# EAGLE design audio_amplifier (EAGLE 6.2)
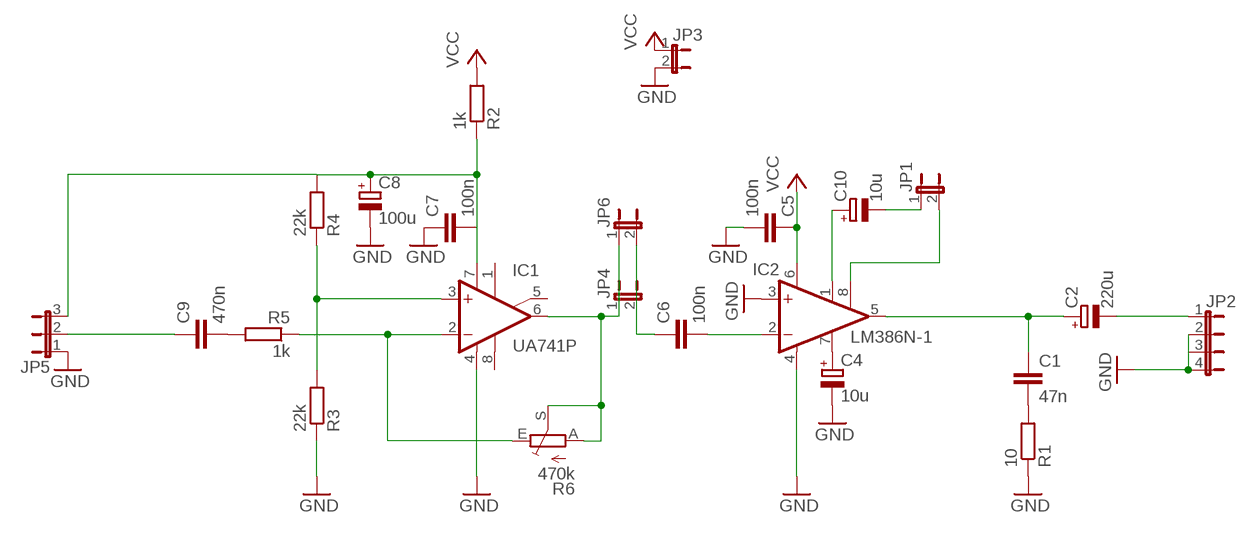
[diagram p0: schematic, sheet 1]

## Parts
C1  47n  C-EU025-024X044  [C025-024X044]
C2  220u  CPOL-EUE2.5-6  [E2,5-6]
C4  10u  CPOL-EUB/3528-21R  [B/3528-21R]
C5  100n  C-EU050-025X075  [C050-025X075]
C6  100n  C-EU050-025X075  [C050-025X075]
C7  100n  C-EU025-024X044  [C025-024X044]
C8  100u  CPOL-EUE2.5-5  [E2,5-5]
C9  470n  C-EU050-025X075  [C050-025X075]
C10  10u  CPOL-EUE2.5-5  [E2,5-5]
IC1  UA741P  [DIL08]
IC2  LM386N-1  [DIL08]
JP1  JP1E  [JP1]
JP2  JP4E  [JP4]
JP3  JP1E  [JP1]
JP4  JP1E  [JP1]
JP5  JP2E  [JP2]
JP6  JP1E  [JP1]
R1  10  R-EU_0204/5  [0204/5]
R2  1k  R-EU_0204/5  [0204/5]
R3  22k  R-EU_0204/7  [0204/7]
R4  22k  R-EU_0204/5  [0204/5]
R5  1k  R-EU_0204/2V  [0204V]
R6  470k  TRIM_EU-B64Y  [B64Y]

## Nets
GND: C4.- C5.2 C7.1 C8.- IC1.4(V-) IC2.3(+IN) IC2.4(GND) JP2.2 JP2.3 JP2.4 JP3.2 JP5.1 R1.1 R3.1
N$1: C10.+ IC2.1(GAIN)
N$2: C1.2 R1.2
N$4: C4.+ IC2.7(BYPASS)
N$6: C6.2 IC2.2(-IN)
N$7: C7.2 C8.+ IC1.7(V+) JP5.3 R2.1 R4.2
N$8: IC1.3(+IN) R3.2 R4.1
N$9: C9.2 R5.2
N$10: IC1.2(-IN) R5.1 R6.E
N$11: C2.- JP2.1
N$12: C10.- JP1.1
N$13: IC2.8(GAIN) JP1.2
N$14: C6.1 JP4.2 JP6.2
N$15: IC1.6(OUT) JP4.1 JP6.1 R6.A R6.S
N$17: C1.1 C2.+ IC2.5(OUT)
N$19: C9.1 JP5.2
VCC: C5.1 IC2.6(VS) JP3.1 R2.2
Unconnected: IC1.1(ON1) IC1.5(ON2) IC1.8(OPT)

## Library data of the parts
C1 C5-C7 C9 = rcl:C-EU: CAPACITOR, European symbol
C2 C4 C8 C10 = rcl:CPOL-EU: POLARIZED CAPACITOR, European symbol
IC1 = linear:*741: OP AMP
IC2 = linear:LM386?-*: Low Voltage Audio Power Amplifier Source: http://cache.national.com/ds/LM/LM386.pdf
JP1 JP3 JP4 JP6 = jumper:JP1E: JUMPER
JP2 = jumper:JP4E: JUMPER
JP5 = jumper:JP2E: JUMPER
R1-R5 = rcl:R-EU_: RESISTOR, European symbol
R6 = pot:TRIM_EU-: POTENTIOMETER

## Board
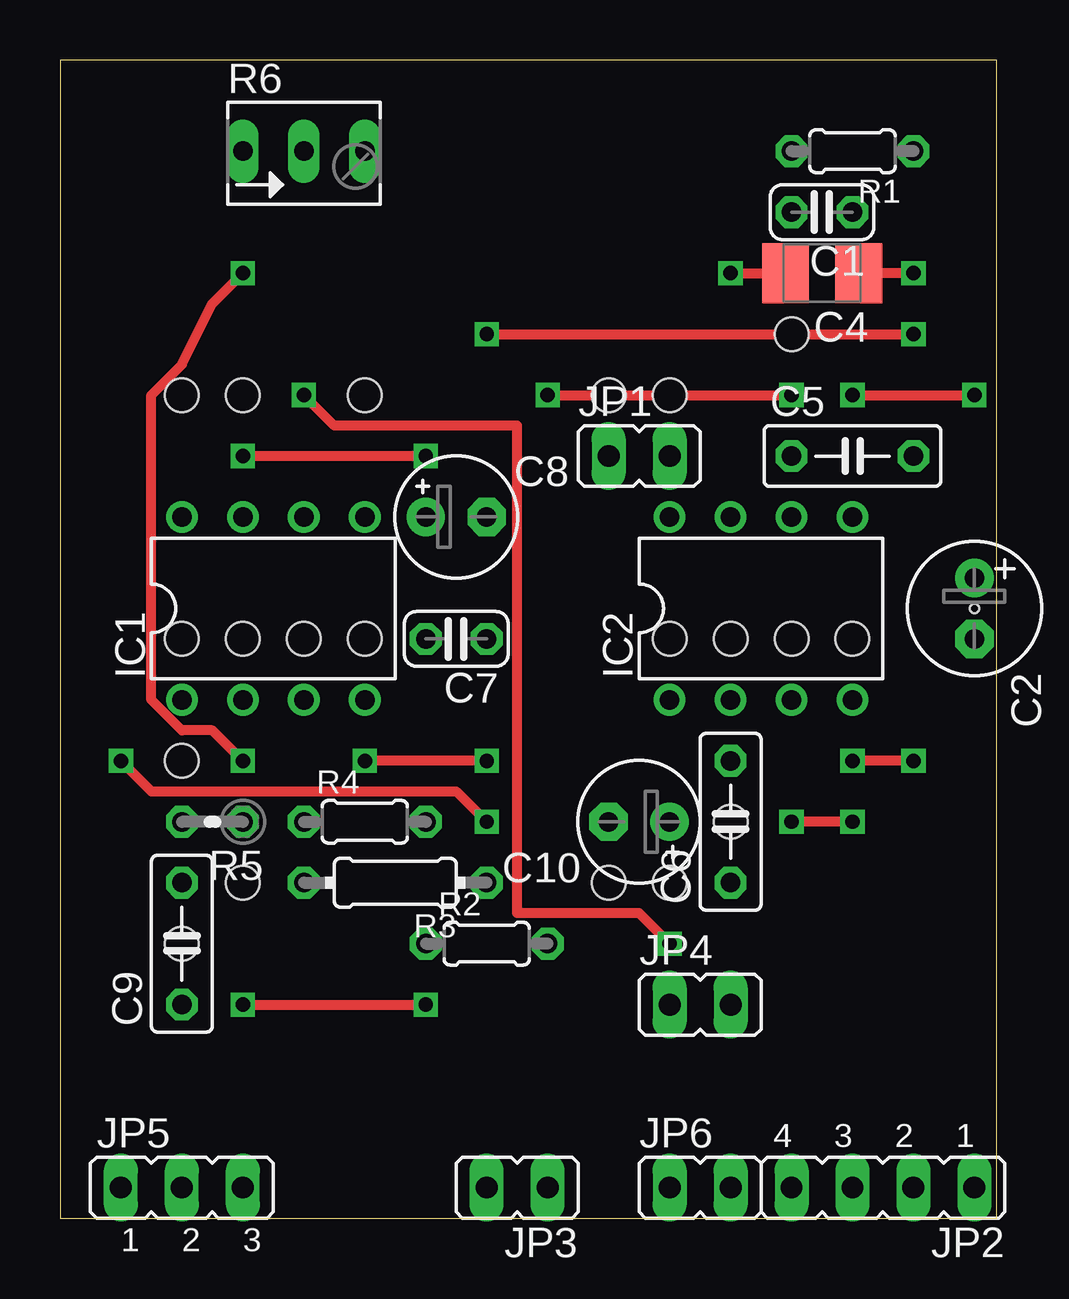
[diagram p1: board, top side]
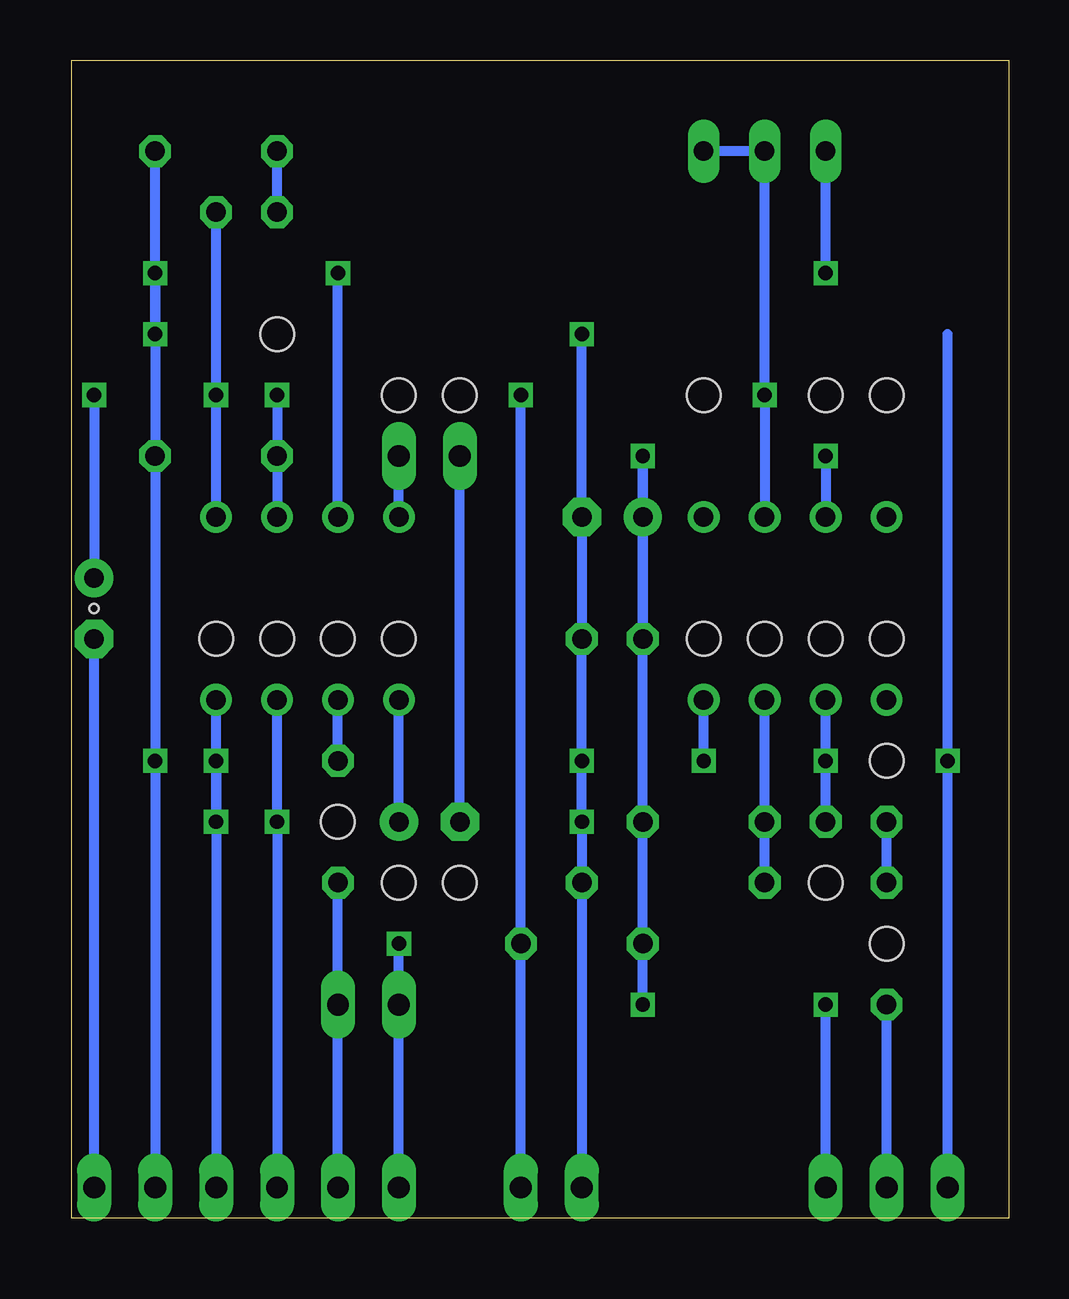
[diagram p2: board, bottom side, seen from below]

Size 39.04 x 48.25 mm. Coordinates in mm from the lower left corner, seen from the top.
Outline: 0,0 39.04,0 39.04,48.25 0,48.25 0,0
Copper layers (1*16): Top 0.035mm / dielectric 1.5mm / Bottom 0.035mm
Design rules: minimum track width 10mil, minimum drill 24mil, track to track 8mil, track to pad 8mil, pad to pad 8mil, via to via 8mil, smd to smd 8mil, copper to edge 40mil, drill to drill 8mil, minimum pad ring 10mil, minimum via ring 8mil, stop-mask expansion 4mil, vias tented up to drill 0mil, thermal gap 10mil
Holes 1.4 mm at 25.4,34.29 22.86,13.97 27.94,16.51 25.4,13.97 22.86,34.29 30.48,36.83 5.08,19.05 5.08,34.29 7.62,34.29 12.7,34.29 5.08,11.43 7.62,13.97 5.08,24.13 7.62,24.13 10.16,24.13 12.7,24.13 25.4,24.13 27.94,24.13 30.48,24.13 33.02,24.13
Holes 0.38 mm at 38.1,25.4

### Footprints (pad centres in the part's own frame; a part is rotated, then mirrored left to right if it is on the bottom)
C025-024X044 = drill 0.813 octagon: 1 -1.27,0; 2 1.27,0
E2,5-6 = drill 0.813 pad 1.6: + -1.27,0 | drill 0.813 pad 1.6 octagon: - 1.27,0
B/3528-21R = smd 1.95 x 2.5: + 1.525,0; - -1.525,0
C050-025X075 = drill 0.813 octagon: 1 -2.54,0; 2 2.54,0
E2,5-5 = drill 0.813 pad 1.6: + -1.27,0 | drill 0.813 pad 1.6 octagon: - 1.27,0
DIL08 = drill 0.813 pad 1.27: 1 -3.81,-3.81; 2 -1.27,-3.81; 3 1.27,-3.81; 4 3.81,-3.81; 5 3.81,3.81; 6 1.27,3.81; 7 -1.27,3.81; 8 -3.81,3.81
JP1 = drill 0.914 long: 1 0,-1.27; 2 0,1.27
JP4 = drill 0.914 long: 1 -3.81,0; 2 -1.27,0; 3 1.27,0; 4 3.81,0
JP2 = drill 0.914 long: 1 -2.54,0; 2 0,0; 3 2.54,0
0204/5 = drill 0.813 octagon: 1 -2.54,0; 2 2.54,0
0204/7 = drill 0.813 octagon: 1 -3.81,0; 2 3.81,0
0204V = drill 0.813 octagon: 1 -1.27,0; 2 1.27,0
B64Y = drill 0.813 long: A 2.54,0; E -2.54,0; S 0,0

### Placement (x,y rotation side)
C1  31.75,41.91 180 top
C2  38.1,25.4 270 top
C4  31.75,39.37 180 top
C5  33.02,31.75 0 top
C6  27.94,16.51 90 top
C7  16.51,24.13 180 top
C8  16.51,29.21 0 top
C9  5.08,11.43 90 top
C10  24.13,16.51 180 top
IC1  8.89,25.4 0 top
IC2  29.21,25.4 0 top
JP1  24.13,31.75 270 top
JP2  34.29,1.27 180 top
JP3  19.05,1.27 90 top
JP4  26.67,8.89 270 top
JP5  5.08,1.27 0 top
JP6  26.67,1.27 270 top
R1  33.02,44.45 180 top
R2  17.78,11.43 0 top
R3  13.97,13.97 180 top
R4  12.7,16.51 0 top
R5  6.35,16.51 180 top
R6  10.16,44.45 0 top

### Tracks (layer width: path | path; a pad name or v marks a point on that pad's centre or on a via)
GND  (via drill 0.6)
  Top 0.406: v35.56,19.05 v33.02,19.05 | v33.02,16.51 v30.48,16.51 | v17.78,36.83 v35.56,36.83 | v35.56,39.37 C4.- | v17.78,19.05 v12.7,19.05 | v2.54,19.05 3.81,17.78 16.51,17.78 v17.78,16.51
  Bottom 0.406: v12.7,19.05 IC1.4 | v33.02,19.05 v33.02,16.51 | v33.02,16.51 IC2.4 | IC2.3 v30.48,16.51 JP2.4 | JP3.2 R3.1 v17.78,16.51 v17.78,19.05 C7.1 C8.- v17.78,36.83 | v35.56,39.37 C5.2 v35.56,19.05 JP2.2 | v35.56,36.83 v35.56,39.37 | v35.56,39.37 R1.1 | JP5.1 v2.54,19.05 2.54,36.83 | v33.02,16.51 JP2.3
N$1
  Bottom 0.406: C10.+ IC2.1
N$2
  Bottom 0.406: C1.2 R1.2
N$4  (via drill 0.6)
  Top 0.406: v27.94,39.37 C4.+
  Bottom 0.406: IC2.7 v27.94,39.37
N$6
  Bottom 0.406: C6.2 IC2.2
N$7  (via drill 0.6)
  Top 0.406: v15.24,31.75 v7.62,31.75 | v7.62,8.89 v15.24,8.89
  Bottom 0.406: R2.1 R4.2 | R2.1 C8.+ v15.24,31.75 | v7.62,31.75 IC1.7 | R2.1 v15.24,31.75 | JP5.3 v7.62,8.89 | v15.24,31.75 C7.2 | v15.24,8.89 R2.1
N$8
  Bottom 0.406: R4.1 R3.2 IC1.3
N$9
  Bottom 0.406: C9.2 R5.2
N$10  (via drill 0.6)
  Top 0.406: v7.62,19.05 6.35,20.32 5.08,20.32 3.81,21.59 3.81,34.29 5.08,35.56 6.35,38.1 v7.62,39.37
  Bottom 0.406: R5.1 v7.62,19.05 IC1.2 | v7.62,39.37 R6.E
N$11
  Bottom 0.406: JP2.1 C2.-
N$12
  Bottom 0.406: C10.- JP1.1
N$13
  Bottom 0.406: IC2.8 JP1.2
N$14
  Bottom 0.406: JP6.2 JP4.2 C6.1
N$15  (via drill 0.6)
  Top 0.406: v25.4,11.43 24.13,12.7 19.05,12.7 19.05,33.02 11.43,33.02 v10.16,34.29
  Bottom 0.406: IC1.6 v10.16,34.29 R6.S R6.A | v25.4,11.43 JP4.1 JP6.1
N$17  (via drill 0.6)
  Top 0.406: v33.02,34.29 v38.1,34.29
  Bottom 0.406: IC2.5 v33.02,34.29 C1.1 | v38.1,34.29 C2.+
N$19
  Bottom 0.406: JP5.2 C9.1
VCC  (via drill 0.6)
  Top 0.406: v20.32,34.29 v30.48,34.29
  Bottom 0.406: JP3.1 R2.2 v20.32,34.29 | IC2.6 C5.1 v30.48,34.29